# Altium schematic sheet RS485 Multiplexer.SchDoc: RS485 Multiplexer
size 292 x 193 mm; SheetNumber: 15; SheetTotal: 21
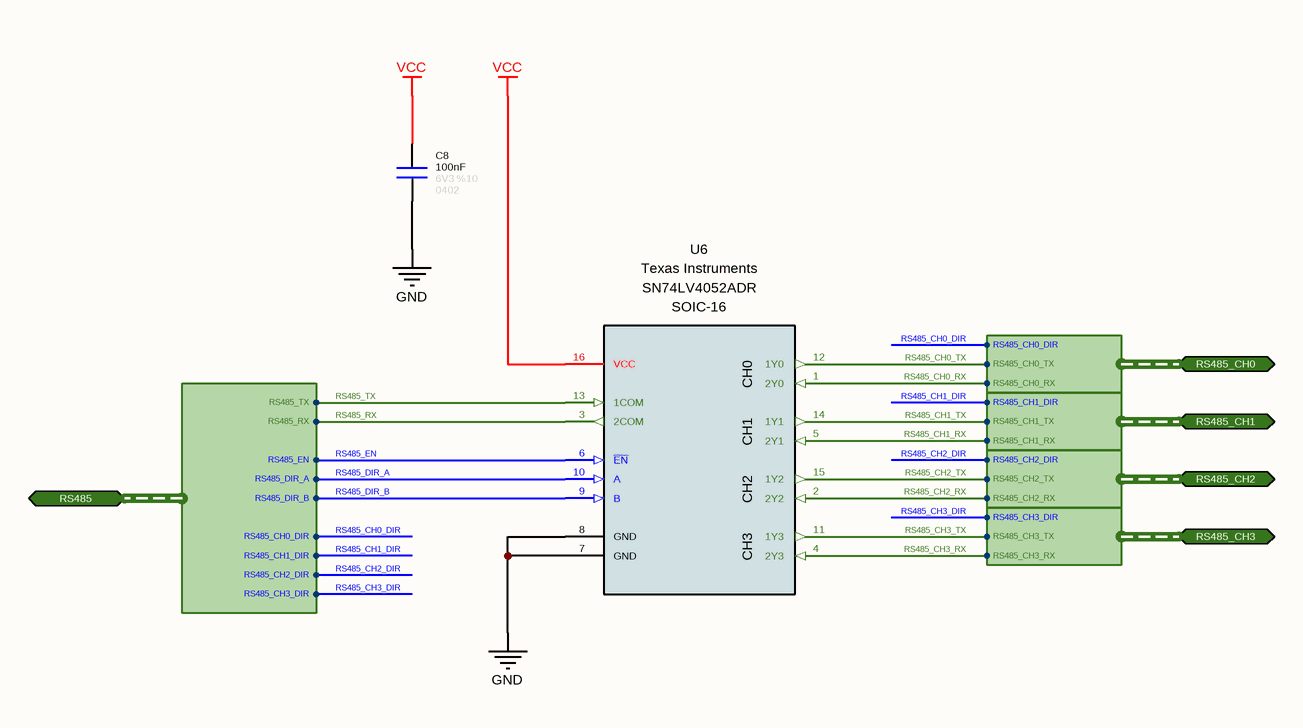
[diagram p0: RS485 Multiplexer.SchDoc]

## Parts
C8  value 100nF  Tolerance: %10  Voltage: 6V3  Case: 0402  [CAPACITOR_0402]  (hidden comment: Capacitor - 100nF [0402] (Ceramic))
U6  Manufacturer Name: Texas Instruments  Case: SOIC-16  [SOIC-16 Narrow]  (hidden comment: SN74LV4052ADR)

## Ports
RS485 (bidir, harness RS485), RS485_CH0 (bidir, harness RS485_CH0), RS485_CH1 (bidir, harness RS485_CH1), RS485_CH2 (bidir, harness RS485_CH2), RS485_CH3 (bidir, harness RS485_CH3)

## Harnesses
RS485_CH0: RS485_CH0_RX, RS485_CH0_TX, RS485_CH0_DIR
RS485_CH1: RS485_CH1_RX, RS485_CH1_TX, RS485_CH1_DIR
RS485_CH2: RS485_CH2_RX, RS485_CH2_TX, RS485_CH2_DIR
RS485_CH3: RS485_CH3_RX, RS485_CH3_TX, RS485_CH3_DIR
RS485: RS485_RX, RS485_TX, RS485_EN, RS485_DIR_A, RS485_DIR_B, RS485_CH0_DIR, RS485_CH1_DIR, RS485_CH2_DIR, RS485_CH3_DIR

## Nets
GND: C8.1 U6.7(GND) U6.8(GND)
VCC: C8.2 U6.16(VCC)
RS485_CH0_DIR: port RS485_CH0.RS485_CH0_DIR, port RS485.RS485_CH0_DIR
RS485_CH0_RX: U6.1(2Y0) ; port RS485_CH0.RS485_CH0_RX
RS485_CH0_TX: U6.12(1Y0) ; port RS485_CH0.RS485_CH0_TX
RS485_CH1_DIR: port RS485_CH1.RS485_CH1_DIR, port RS485.RS485_CH1_DIR
RS485_CH1_RX: U6.5(2Y1) ; port RS485_CH1.RS485_CH1_RX
RS485_CH1_TX: U6.14(1Y1) ; port RS485_CH1.RS485_CH1_TX
RS485_CH2_DIR: port RS485_CH2.RS485_CH2_DIR, port RS485.RS485_CH2_DIR
RS485_CH2_RX: U6.2(2Y2) ; port RS485_CH2.RS485_CH2_RX
RS485_CH2_TX: U6.15(1Y2) ; port RS485_CH2.RS485_CH2_TX
RS485_CH3_DIR: port RS485_CH3.RS485_CH3_DIR, port RS485.RS485_CH3_DIR
RS485_CH3_RX: U6.4(2Y3) ; port RS485_CH3.RS485_CH3_RX
RS485_CH3_TX: U6.11(1Y3) ; port RS485_CH3.RS485_CH3_TX
RS485_DIR_A: U6.10(A) ; port RS485.RS485_DIR_A
RS485_DIR_B: U6.9(B) ; port RS485.RS485_DIR_B
RS485_EN: U6.6(~{EN}) ; port RS485.RS485_EN
RS485_RX: U6.3(2COM) ; port RS485.RS485_RX
RS485_TX: U6.13(1COM) ; port RS485.RS485_TX

## Notes on the sheet
- © 2021 All rights reserved.
  This document may not, in whole or in part, be copied, photocopied, reproduced, translated or converted to any electronic or machine readable from without prior written permission of Mehmet Günce Akkoyun.
  Engineer contact : akkoyun@me.com
- Property of
- Engineer :
- Date :
- Size :
- A4
- Time :
- Project :
- Page :
- /
- Customer :
- Product ID :
- Module ID :
- Version :
- File :
- Revision :
- (in symbol IC - SN74LV4052ADR) CH0; CH1; CH2; CH3

## Library data of the parts
C8 = Capacitor - 100nF [0402-6V3]: Capacitor - 100nF [0402-6V3] (Ceramic); Manufacturer Name: AVX; Manufacturer Part Number: 04026D104KAT4A; ComponentLink1Description: Mouser; ComponentLink1URL: https://www.mouser.com.tr/ProductDetail/AVX/04026D104KAT4A?qs=sGAEpiMZZMs0AnBnWHyRQPg4iYkCw7IMED%2F4kpqgf7w%3D; ComponentLink2Description: DataSheet; ComponentLink2URL: https://www.mouser.com.tr/datasheet/2/40/cx5r-776519.pdf
U6 = IC - SN74LV4052ADR: Multiplexer Switch ICs Dual 4-Ch Analog Mltplxr/Demltplxr; Channel: 4; Maximum Operating Temperature: + 85 C; Minimum Operating Temperature: - 40 C; Product Type: Multiplexer Switch ICs; Manufacturer Part Number: SN74LV4052ADR